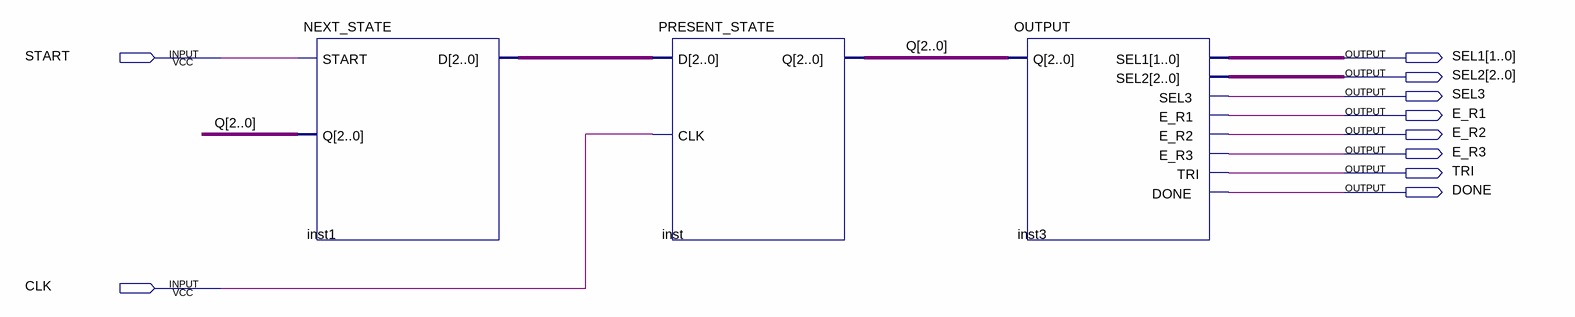
[diagram p0: schematic sheet]
// Quartus schematic Register_Sharing_CONTROLLER.bdf as structural Verilog: 3 symbols, 10 pins
module Register_Sharing_CONTROLLER (
  input  START,
  input  CLK,
  output [1:0] SEL1,
  output [2:0] SEL2,
  output SEL3,
  output E_R1,
  output E_R2,
  output E_R3,
  output TRI,
  output DONE
);

  wire [2:0] inst1_d, Q;

  NEXT_STATE inst1 (.START(START), .Q(Q), .D(inst1_d));
  PRESENT_STATE inst (.CLK(CLK), .D(inst1_d), .Q(Q));
  OUTPUT inst3 (
    .Q(Q), .SEL1(SEL1), .SEL2(SEL2), .SEL3(SEL3), .E_R1(E_R1), .E_R2(E_R2), .E_R3(E_R3), .TRI(TRI),
    .DONE(DONE));
endmodule
